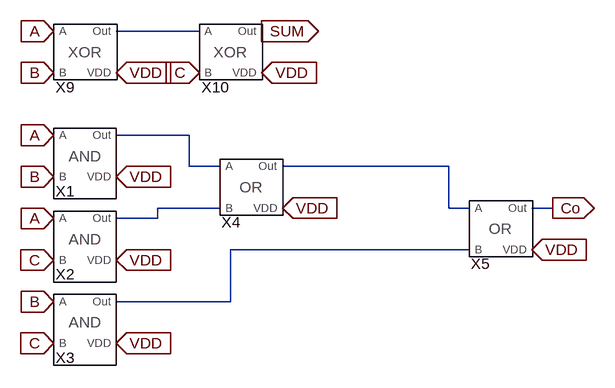
[diagram p0: schematic Full_Adder.asc]
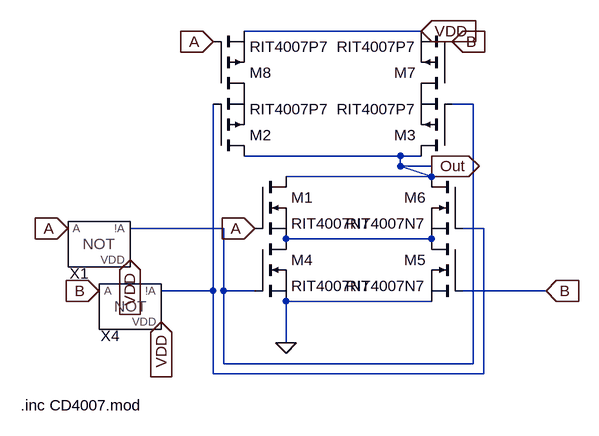
[diagram p1: sub-circuit gate_xor.asc]
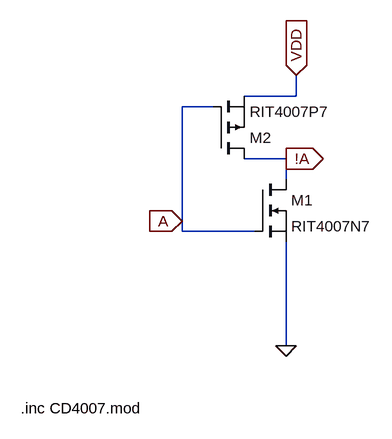
[diagram p2: sub-circuit gate_not.asc]
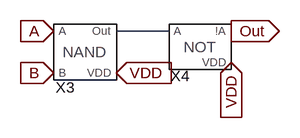
[diagram p3: sub-circuit gate_and.asc]
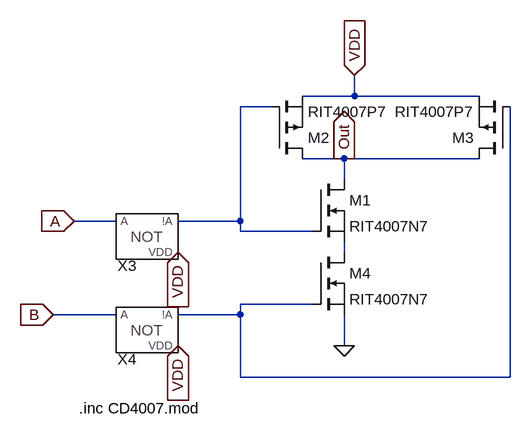
[diagram p4: sub-circuit gate_or.asc]
Full_Adder.asc, the LTspice schematic file:
Version 4
SHEET 1 880 680
WIRE -224 -64 -352 -64
WIRE -240 96 -352 96
WIRE -240 144 -240 96
WIRE -192 144 -240 144
WIRE 160 144 -96 144
WIRE -192 208 -288 208
WIRE 160 208 160 144
WIRE 192 208 160 208
WIRE 320 208 288 208
WIRE -288 224 -288 208
WIRE -288 224 -352 224
WIRE 192 272 -176 272
WIRE -176 352 -176 272
WIRE -176 352 -352 352
FLAG -448 -64 A
IOPIN -448 -64 In
FLAG -448 0 B
IOPIN -448 0 In
FLAG -224 0 C
IOPIN -224 0 In
FLAG -352 0 VDD
IOPIN -352 0 In
FLAG -128 0 VDD
IOPIN -128 0 In
FLAG -128 -64 SUM
IOPIN -128 -64 Out
FLAG -352 160 VDD
IOPIN -352 160 In
FLAG -352 288 VDD
IOPIN -352 288 In
FLAG -352 416 VDD
IOPIN -352 416 In
FLAG -448 96 A
IOPIN -448 96 In
FLAG -448 160 B
IOPIN -448 160 In
FLAG -448 224 A
IOPIN -448 224 In
FLAG -448 288 C
IOPIN -448 288 In
FLAG -448 416 C
IOPIN -448 416 In
FLAG -448 352 B
IOPIN -448 352 In
FLAG -96 208 VDD
IOPIN -96 208 In
FLAG 288 272 VDD
IOPIN 288 272 In
FLAG 320 208 Co
IOPIN 320 208 Out
SYMBOL Gate_XOR -400 -32 R0
SYMATTR InstName X9
SYMBOL Gate_XOR -176 -32 R0
SYMATTR InstName X10
SYMBOL Gate_AND -400 128 R0
SYMATTR InstName X1
SYMBOL Gate_AND -400 256 R0
SYMATTR InstName X2
SYMBOL Gate_AND -400 384 R0
SYMATTR InstName X3
SYMBOL Gate_OR -144 176 R0
SYMATTR InstName X4
SYMBOL Gate_OR 240 240 R0
SYMATTR InstName X5

gate_xor.asc, the sub-circuit schematic file:
Version 4
SHEET 1 880 680
WIRE 256 -208 -16 -208
WIRE 336 -96 304 -96
WIRE 224 -16 -16 -16
WIRE 256 -16 224 -16
WIRE 224 0 224 -16
WIRE 272 0 224 0
WIRE 272 16 224 0
WIRE 272 16 48 16
WIRE -48 96 -192 96
WIRE 352 96 320 96
WIRE 272 112 48 112
WIRE -64 192 -64 -96
WIRE -64 192 -144 192
WIRE -48 192 -48 96
WIRE 0 192 -48 192
WIRE 448 192 320 192
WIRE 272 208 48 208
WIRE 48 272 48 208
WIRE -48 304 -48 192
WIRE 336 304 336 -96
WIRE 336 304 -48 304
WIRE -64 320 -64 192
WIRE 352 320 352 96
WIRE 352 320 -64 320
FLAG 48 272 0
FLAG 256 -208 VDD
IOPIN 256 -208 In
FLAG -240 192 B
IOPIN -240 192 In
FLAG -288 96 A
IOPIN -288 96 In
FLAG 304 -192 B
IOPIN 304 -192 In
FLAG 0 96 A
IOPIN 0 96 In
FLAG 448 192 B
IOPIN 448 192 In
FLAG -64 -192 A
IOPIN -64 -192 In
FLAG 272 0 Out
IOPIN 272 0 Out
FLAG -192 144 VDD
IOPIN -192 144 In
FLAG -144 240 VDD
IOPIN -144 240 In
SYMBOL nmos 0 16 R0
SYMATTR InstName M1
SYMATTR Value RIT4007N7
SYMBOL pmos -64 -16 M180
SYMATTR InstName M2
SYMATTR Value RIT4007P7
SYMBOL pmos 304 -16 R180
SYMATTR InstName M3
SYMATTR Value RIT4007P7
SYMBOL nmos 0 112 R0
SYMATTR InstName M4
SYMATTR Value RIT4007N7
SYMBOL nmos 320 112 M0
SYMATTR InstName M5
SYMATTR Value RIT4007N7
SYMBOL nmos 320 16 M0
SYMATTR InstName M6
SYMATTR Value RIT4007N7
SYMBOL pmos 304 -112 R180
SYMATTR InstName M7
SYMATTR Value RIT4007P7
SYMBOL pmos -64 -112 M180
SYMATTR InstName M8
SYMATTR Value RIT4007P7
SYMBOL Gate_NOT -240 128 R0
SYMATTR InstName X1
SYMBOL Gate_NOT -192 224 R0
SYMATTR InstName X4
TEXT -360 368 Left 2 !.inc CD4007.mod

gate_not.asc, the sub-circuit schematic file:
Version 4
SHEET 1 880 680
WIRE 64 -112 64 -144
WIRE 64 -112 -16 -112
WIRE -64 -96 -112 -96
WIRE 48 -16 -16 -16
WIRE 48 16 48 -16
WIRE -112 80 -112 -96
WIRE -112 96 -112 80
WIRE 0 96 -112 96
WIRE 48 272 48 112
FLAG 48 272 0
FLAG -112 80 A
IOPIN -112 80 In
FLAG 48 -16 !A
IOPIN 48 -16 Out
FLAG 64 -144 VDD
IOPIN 64 -144 In
SYMBOL nmos 0 16 R0
SYMATTR InstName M1
SYMATTR Value RIT4007N7
SYMBOL pmos -64 -16 M180
SYMATTR InstName M2
SYMATTR Value RIT4007P7
TEXT -360 368 Left 2 !.inc CD4007.mod

gate_and.asc, the sub-circuit schematic file:
Version 4
SHEET 1 880 680
WIRE -144 0 -224 0
FLAG -224 64 VDD
IOPIN -224 64 In
FLAG -48 48 VDD
IOPIN -48 48 In
FLAG -320 64 B
IOPIN -320 64 In
FLAG -320 0 A
IOPIN -320 0 In
FLAG -48 0 Out
IOPIN -48 0 Out
SYMBOL Gate_NAND -272 32 R0
SYMATTR InstName X3
SYMBOL Gate_NOT -96 32 R0
SYMATTR InstName X4

gate_or.asc, the sub-circuit schematic file:
Version 4
SHEET 1 880 680
WIRE 64 -112 64 -144
WIRE 64 -112 -16 -112
WIRE 256 -112 64 -112
WIRE -64 -96 -112 -96
WIRE 48 -16 -16 -16
WIRE 256 -16 48 -16
WIRE 48 16 48 -16
WIRE -304 80 -368 80
WIRE -112 80 -112 -96
WIRE -112 80 -208 80
WIRE -112 96 -112 80
WIRE 0 96 -112 96
WIRE 48 128 48 112
WIRE 0 208 -112 208
WIRE -304 224 -400 224
WIRE -112 224 -112 208
WIRE -112 224 -208 224
WIRE 48 272 48 224
WIRE -112 320 -112 224
WIRE 304 320 304 -96
WIRE 304 320 -112 320
FLAG 48 272 0
FLAG -368 80 A
IOPIN -368 80 In
FLAG -400 224 B
IOPIN -400 224 In
FLAG 48 -16 Out
IOPIN 48 -16 Out
FLAG 64 -144 VDD
IOPIN 64 -144 In
FLAG -208 128 VDD
IOPIN -208 128 In
FLAG -208 272 VDD
IOPIN -208 272 In
SYMBOL nmos 0 16 R0
SYMATTR InstName M1
SYMATTR Value RIT4007N7
SYMBOL pmos -64 -16 M180
SYMATTR InstName M2
SYMATTR Value RIT4007P7
SYMBOL pmos 304 -16 R180
SYMATTR InstName M3
SYMATTR Value RIT4007P7
SYMBOL nmos 0 128 R0
SYMATTR InstName M4
SYMATTR Value RIT4007N7
SYMBOL Gate_NOT -256 112 R0
SYMATTR InstName X3
SYMBOL Gate_NOT -256 256 R0
SYMATTR InstName X4
TEXT -360 368 Left 2 !.inc CD4007.mod

The netlist it stands for:
* Full_Adder.asc
XX9 A B N001 VDD gate_xor
XX10 N001 C SUM VDD gate_xor
XX1 A B N002 VDD gate_and
XX2 A C N004 VDD gate_and
XX3 B C N005 VDD gate_and
XX4 N002 N004 N003 VDD gate_or
XX5 N003 N005 Co VDD gate_or

* block symbol definitions
.subckt gate_xor A B Out VDD
M1 Out A N003 N003 RIT4007N7
M2 Out N002 P001 P001 RIT4007P7
M3 Out N001 P002 P002 RIT4007P7
M4 N003 N001 0 0 RIT4007N7
M5 N003 B 0 0 RIT4007N7
M6 Out N002 N003 N003 RIT4007N7
M7 P002 B VDD VDD RIT4007P7
M8 P001 A VDD VDD RIT4007P7
XX1 A VDD N001 gate_not
XX4 B VDD N002 gate_not
.inc CD4007.mod
.ends gate_xor

.subckt gate_not A VDD !A
M1 !A A 0 0 RIT4007N7
M2 !A A VDD VDD RIT4007P7
.inc CD4007.mod
.ends gate_not

.subckt gate_and A B Out VDD
XX3 A B N001 VDD Gate_NAND  ; pins A B Out VDD
XX4 N001 VDD Out gate_not
.ends gate_and

.subckt gate_or A B Out VDD
M1 Out N001 N002 N002 RIT4007N7
M2 Out N001 VDD VDD RIT4007P7
M3 Out N003 VDD VDD RIT4007P7
M4 N002 N003 0 0 RIT4007N7
XX3 A VDD N001 gate_not
XX4 B VDD N003 gate_not
.inc CD4007.mod
.ends gate_or

.model NMOS NMOS
.model PMOS PMOS
.lib standard.mos
.backanno
.end